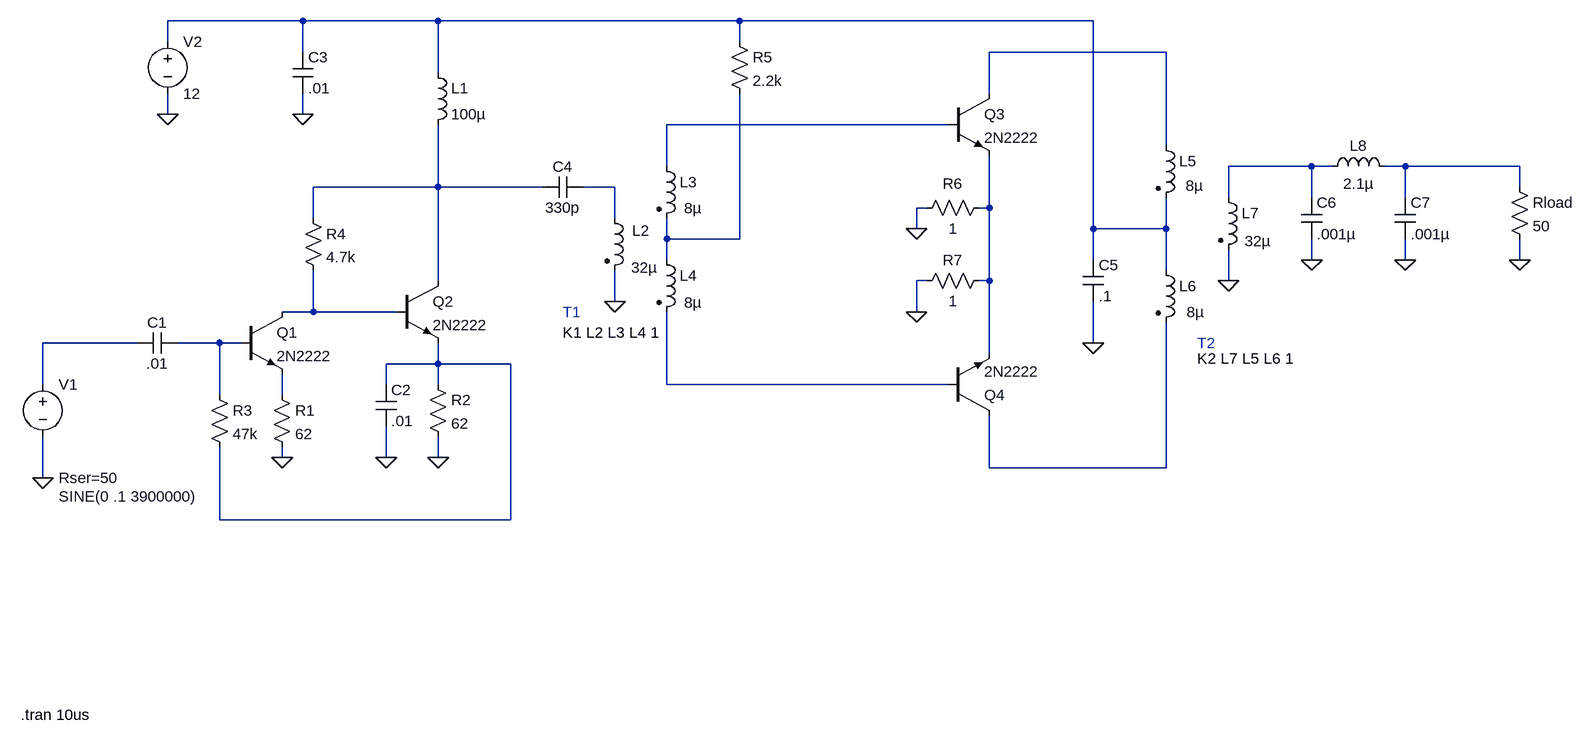
[diagram p0: schematic warbleramp2.asc]
warbleramp2.asc, the LTspice schematic file:
Version 4
SHEET 1 2092 1048
WIRE -272 400 -272 336
WIRE -272 544 -272 480
WIRE -128 336 -272 336
WIRE -80 -128 -80 -160
WIRE -80 -16 -80 -48
WIRE 0 336 -64 336
WIRE 0 416 0 336
WIRE 0 608 0 496
WIRE 32 336 0 336
WIRE 96 416 96 384
WIRE 96 512 96 496
WIRE 128 -160 -80 -160
WIRE 128 -112 128 -160
WIRE 128 -16 128 -48
WIRE 144 144 144 96
WIRE 144 288 96 288
WIRE 144 288 144 224
WIRE 256 400 256 368
WIRE 256 512 256 464
WIRE 272 288 144 288
WIRE 336 -160 128 -160
WIRE 336 -80 336 -160
WIRE 336 96 144 96
WIRE 336 96 336 0
WIRE 336 240 336 96
WIRE 336 368 256 368
WIRE 336 368 336 336
WIRE 336 400 336 368
WIRE 336 512 336 480
WIRE 448 368 336 368
WIRE 448 608 0 608
WIRE 448 608 448 368
WIRE 496 96 336 96
WIRE 608 96 560 96
WIRE 608 144 608 96
WIRE 608 272 608 224
WIRE 688 64 688 0
WIRE 688 176 688 144
WIRE 688 208 688 176
WIRE 688 400 688 288
WIRE 800 -160 336 -160
WIRE 800 -128 800 -160
WIRE 800 176 688 176
WIRE 800 176 800 -48
WIRE 1072 160 1072 128
WIRE 1072 288 1072 240
WIRE 1088 128 1072 128
WIRE 1088 240 1072 240
WIRE 1120 0 688 0
WIRE 1120 400 688 400
WIRE 1184 -48 1184 -112
WIRE 1184 128 1168 128
WIRE 1184 128 1184 48
WIRE 1184 240 1168 240
WIRE 1184 240 1184 128
WIRE 1184 352 1184 240
WIRE 1184 528 1184 448
WIRE 1344 -160 800 -160
WIRE 1344 160 1344 -160
WIRE 1344 208 1344 160
WIRE 1344 336 1344 272
WIRE 1456 -112 1184 -112
WIRE 1456 32 1456 -112
WIRE 1456 160 1344 160
WIRE 1456 160 1456 112
WIRE 1456 224 1456 160
WIRE 1456 528 1184 528
WIRE 1456 528 1456 304
WIRE 1552 112 1552 64
WIRE 1552 240 1552 192
WIRE 1680 64 1552 64
WIRE 1680 112 1680 64
WIRE 1680 208 1680 176
WIRE 1712 64 1680 64
WIRE 1824 64 1792 64
WIRE 1824 112 1824 64
WIRE 1824 208 1824 176
WIRE 2000 64 1824 64
WIRE 2000 96 2000 64
WIRE 2000 208 2000 176
FLAG -272 544 0
FLAG 96 512 0
FLAG 336 512 0
FLAG 256 512 0
FLAG 128 -16 0
FLAG -80 -16 0
FLAG 608 272 0
FLAG 1072 160 0
FLAG 1072 288 0
FLAG 1344 336 0
FLAG 1552 240 0
FLAG 1680 208 0
FLAG 1824 208 0
FLAG 2000 208 0
SYMBOL npn 32 288 R0
SYMATTR InstName Q1
SYMATTR Value 2N2222
SYMBOL voltage -272 384 R0
WINDOW 3 24 188 Left 0
WINDOW 39 24 160 Left 0
WINDOW 123 0 0 Left 0
SYMATTR Value SINE(0 .1 3900000)
SYMATTR SpiceLine Rser=50
SYMATTR InstName V1
SYMBOL cap -64 320 R90
WINDOW 0 0 32 VBottom 0
WINDOW 3 32 32 VTop 0
SYMATTR InstName C1
SYMATTR Value .01
SYMBOL npn 272 240 R0
SYMATTR InstName Q2
SYMATTR Value 2N2222
SYMBOL res 80 400 R0
SYMATTR InstName R1
SYMATTR Value 62
SYMBOL res 320 384 R0
SYMATTR InstName R2
SYMATTR Value 62
SYMBOL cap 240 400 R0
SYMATTR InstName C2
SYMATTR Value .01
SYMBOL res -16 400 R0
SYMATTR InstName R3
SYMATTR Value 47k
SYMBOL res 128 128 R0
SYMATTR InstName R4
SYMATTR Value 4.7k
SYMBOL ind 320 -96 R0
SYMATTR InstName L1
SYMATTR Value 100µ
SYMBOL cap 112 -112 R0
SYMATTR InstName C3
SYMATTR Value .01
SYMBOL voltage -80 -144 R0
WINDOW 123 0 0 Left 0
WINDOW 39 0 0 Left 0
SYMATTR InstName V2
SYMATTR Value 12
SYMBOL cap 560 80 R90
WINDOW 0 0 32 VBottom 0
WINDOW 3 32 32 VTop 0
SYMATTR InstName C4
SYMATTR Value 330p
SYMBOL ind2 592 128 R0
WINDOW 0 43 35 Left 0
WINDOW 3 41 92 Left 0
SYMATTR InstName L2
SYMATTR Value 32µ
SYMATTR Type ind
SYMBOL ind2 672 48 R0
WINDOW 3 43 80 Left 0
SYMATTR Value 8µ
SYMATTR InstName L3
SYMATTR Type ind
SYMBOL ind2 672 192 R0
WINDOW 3 43 82 Left 0
SYMATTR Value 8µ
SYMATTR InstName L4
SYMATTR Type ind
SYMBOL res 784 -144 R0
SYMATTR InstName R5
SYMATTR Value 2.2k
SYMBOL npn 1120 -48 R0
SYMATTR InstName Q3
SYMATTR Value 2N2222
SYMBOL npn 1120 448 M180
SYMATTR InstName Q4
SYMATTR Value 2N2222
SYMBOL res 1184 112 R90
WINDOW 0 -6 56 VBottom 0
WINDOW 3 32 56 VTop 0
SYMATTR InstName R6
SYMATTR Value 1
SYMBOL res 1184 224 R90
WINDOW 0 0 56 VBottom 0
WINDOW 3 32 56 VTop 0
SYMATTR InstName R7
SYMATTR Value 1
SYMBOL ind2 1440 16 R0
WINDOW 3 46 78 Left 0
SYMATTR Value 8µ
SYMATTR InstName L5
SYMATTR Type ind
SYMBOL ind2 1440 208 R0
WINDOW 3 48 80 Left 0
SYMATTR Value 8µ
SYMATTR InstName L6
SYMATTR Type ind
SYMBOL ind2 1536 96 R0
WINDOW 3 41 83 Left 0
SYMATTR Value 32µ
SYMATTR InstName L7
SYMATTR Type ind
SYMBOL cap 1328 208 R0
SYMATTR InstName C5
SYMATTR Value .1
SYMBOL ind 1696 80 R270
WINDOW 0 32 56 VTop 0
WINDOW 3 5 56 VBottom 0
SYMATTR InstName L8
SYMATTR Value 2.1µ
SYMBOL cap 1664 112 R0
SYMATTR InstName C6
SYMATTR Value .001µ
SYMBOL cap 1808 112 R0
SYMATTR InstName C7
SYMATTR Value .001µ
SYMBOL res 1984 80 R0
SYMATTR InstName Rload
SYMATTR Value 50
TEXT 528 320 Left 0 !K1 L2 L3 L4 1
TEXT 528 288 Left 0 ;T1
TEXT 1504 360 Left 0 !K2 L7 L5 L6 1
TEXT 1504 336 Left 0 ;T2
TEXT -306 908 Left 0 !.tran 10us

The netlist it stands for:
* warbleramp2.asc
Q1 N007 N003 N005 0 2N2222
V1 N001 0 SINE(0 .1 3900000) Rser=50
C1 N003 N001 .01
Q2 N006 N007 N004 0 2N2222
R1 N005 0 62
R2 N004 0 62
C2 N004 0 .01
R3 N003 N004 47k
R4 N006 N007 4.7k
L1 N002 N006 100µ
C3 N002 0 .01
V2 N002 0 12
C4 N008 N006 330p
L2 N008 0 32µ
L3 N009 N010 8µ
L4 N010 N011 8µ
R5 N002 N010 2.2k
Q3 N012 N009 N013 0 2N2222
Q4 N014 N011 N013 0 2N2222
R6 N013 0 1
R7 N013 0 1
L5 N012 N002 8µ
L6 N002 N014 8µ
L7 N015 0 32µ
C5 N002 0 .1
L8 N015 N016 2.1µ
C6 N015 0 .001µ
C7 N016 0 .001µ
Rload N016 0 50
.model NPN NPN
.model PNP PNP
.lib standard.bjt
K1 L2 L3 L4 1
* T1
K2 L7 L5 L6 1
* T2
.tran 10us
.backanno
.end